# Altium project Isolated_Oscilloscope_Diferential_Probe.PrjPcb (part 1 of 2)
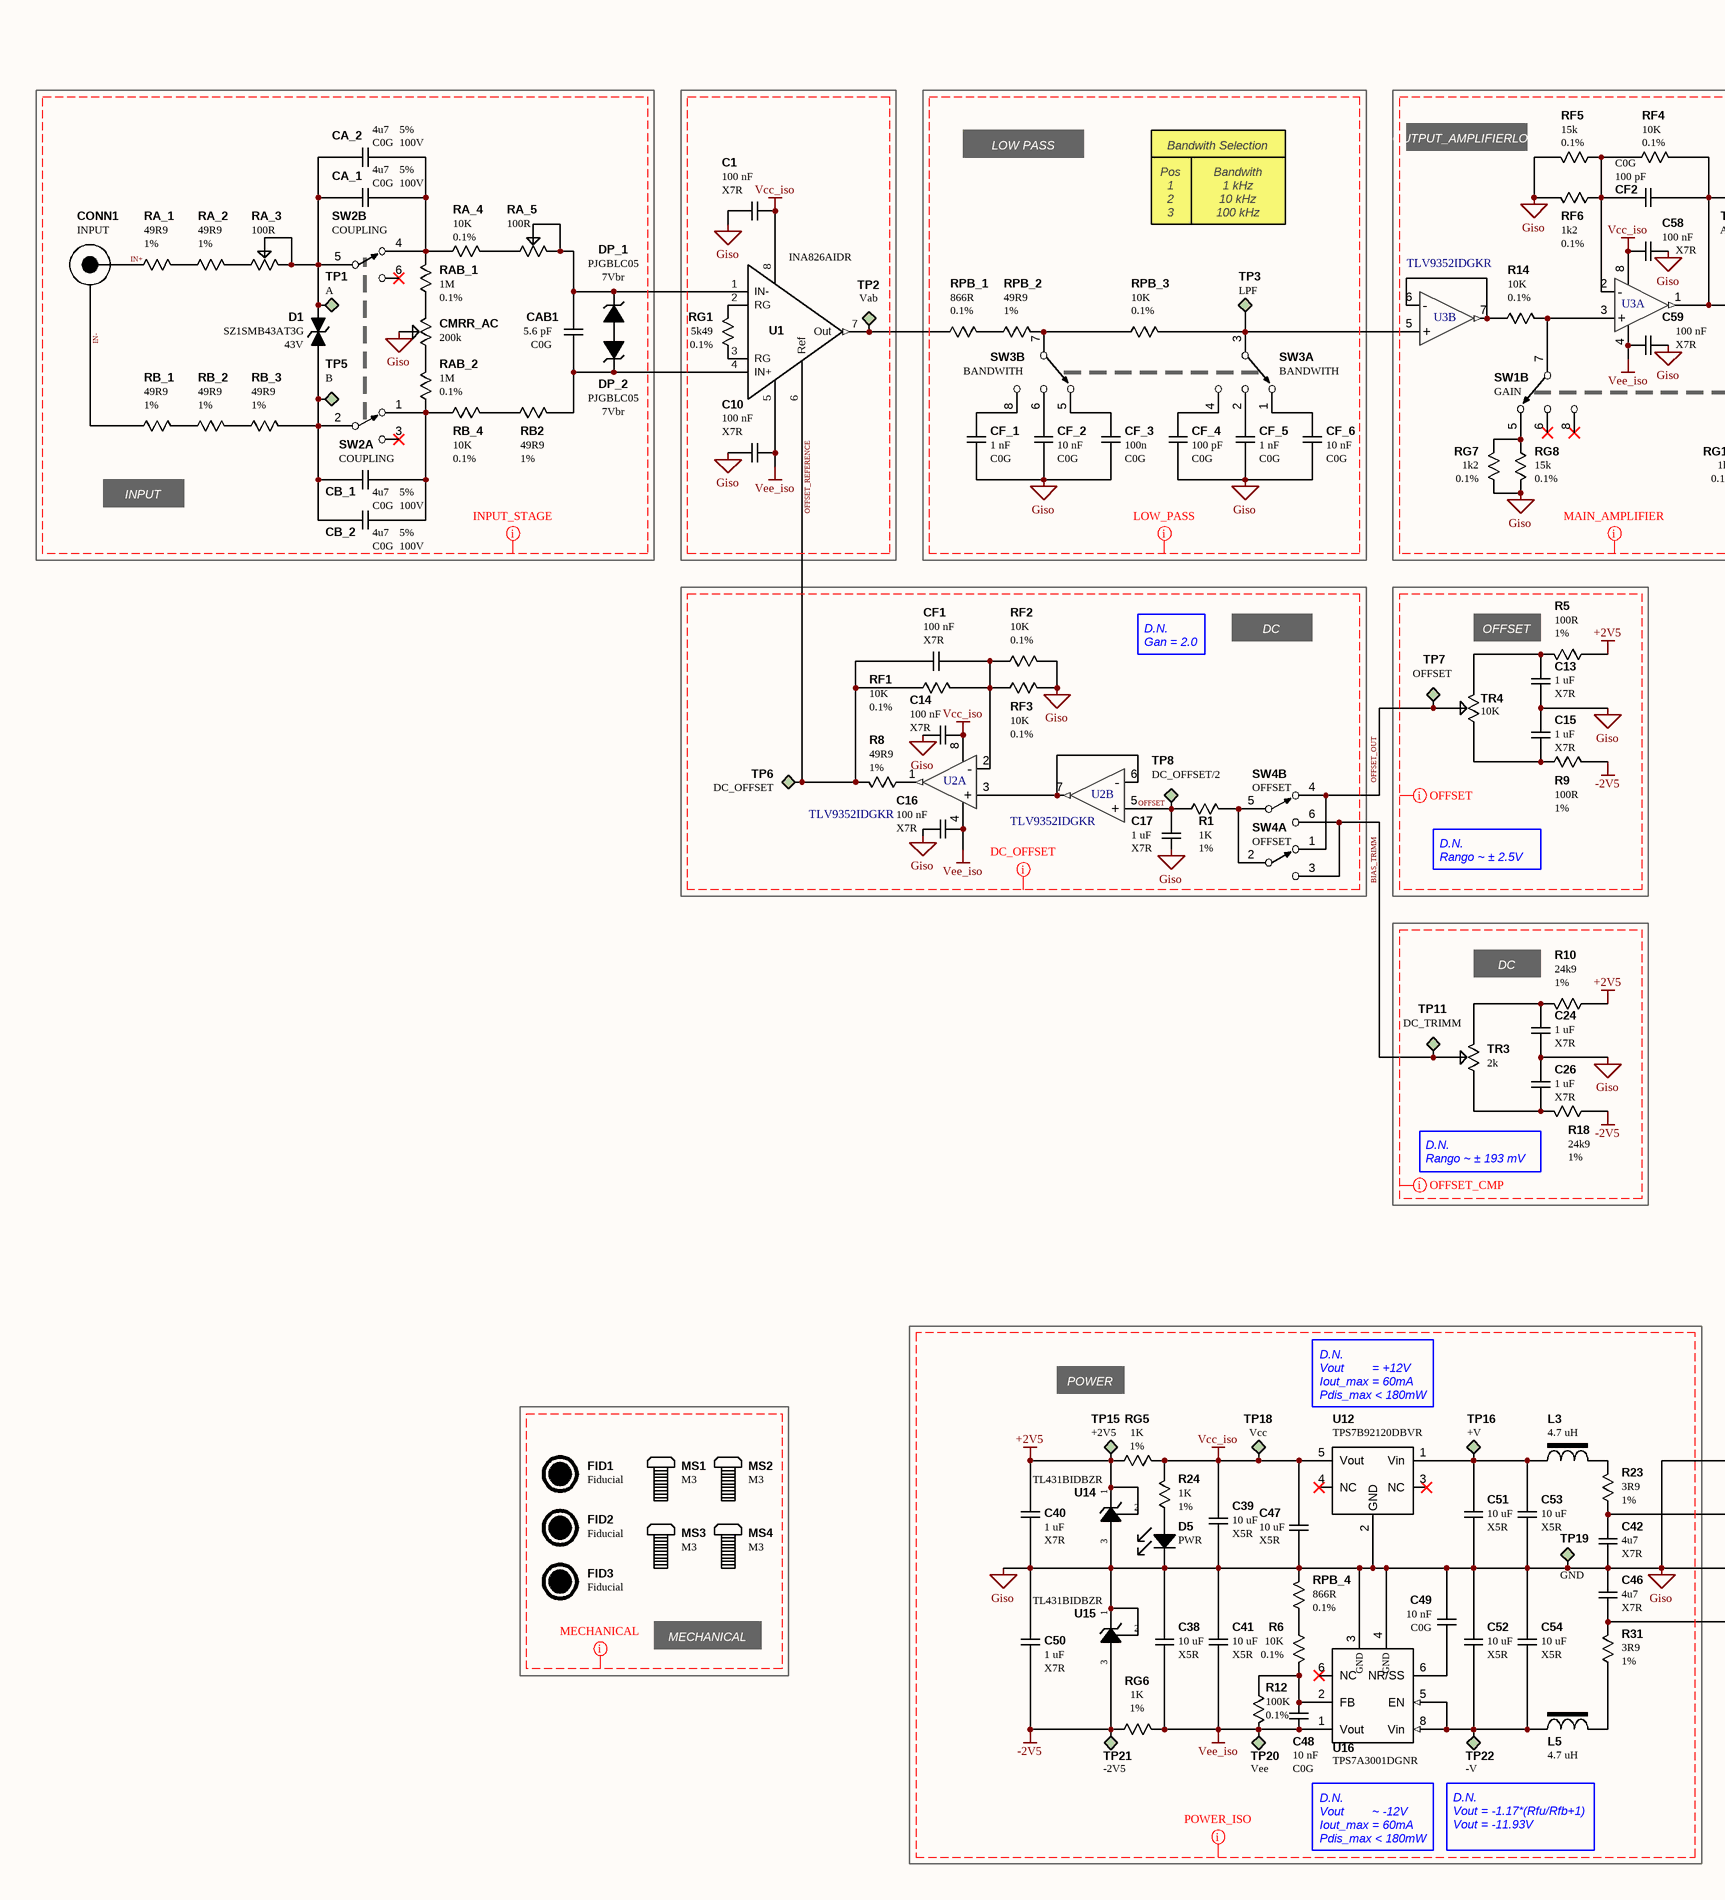
[diagram p0: Isolated_Oscilloscope_Diferential_Probe.SchDoc, left]
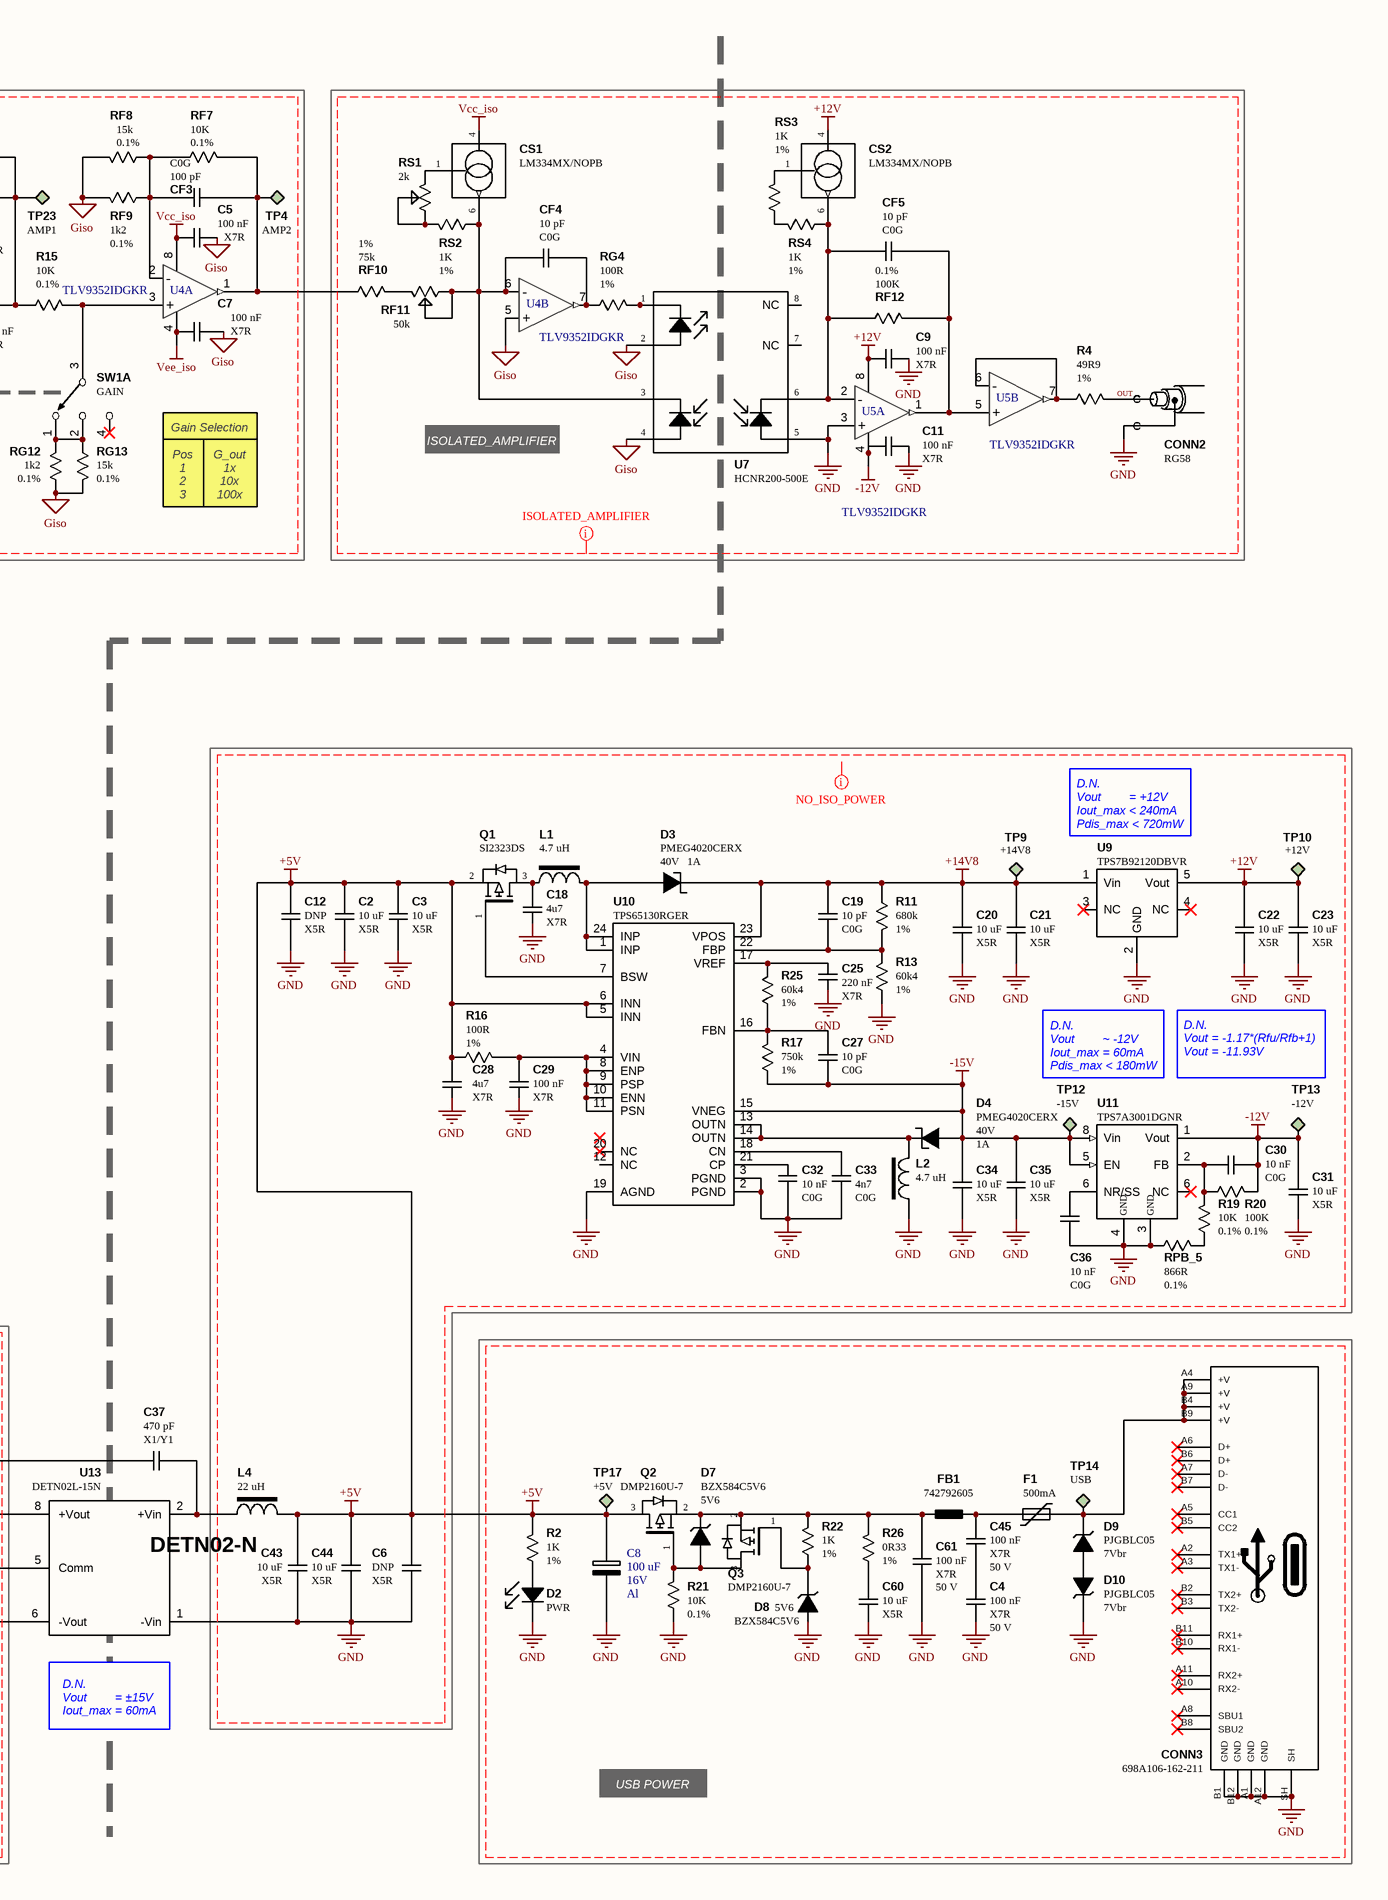
[diagram p1: Isolated_Oscilloscope_Diferential_Probe.SchDoc, right]
1 sheet, 217 parts. Net scope: global (net labels, ports and power ports of the same name join across sheets).
Board file: Isolated_Oscilloscope_Diferential_Probe.PcbDoc

## Sheet Isolated_Oscilloscope_Diferential_Probe.SchDoc: Low Noise Oscilloscope Amplifier
size 594 x 420 mm; Date: 15/04/2026; Revision: A; SheetNumber: 1; SheetTotal: 1

### Parts
C1  100 nF  Dielectrico: X7R  [CAP_SMD_0603]
C2  10 uF  Dielectrico: X5R  [CAP_SMD_0805]
C3  10 uF  Dielectrico: X5R  [CAP_SMD_0805]
C4  100 nF  Tensión: 50 V  Dielectrico: X7R  [CAP_SMD_0603]
C5  100 nF  Dielectrico: X7R  [CAP_SMD_0603]
C6  DNP  Dielectrico: X5R  [CAP_SMD_0805]
C7  100 nF  Dielectrico: X7R  [CAP_SMD_0603]
C8  100 uF  Tensión: 16V  Dielectrico: Al  [CAP_SMD_RADIAL_6.3mm]
C9  100 nF  Dielectrico: X7R  [CAP_SMD_0603]
C10  100 nF  Dielectrico: X7R  [CAP_SMD_0603]
C11  100 nF  Dielectrico: X7R  [CAP_SMD_0603]
C12  DNP  Dielectrico: X5R  [CAP_SMD_0805]
C13  1 uF  Dielectrico: X7R  [CAP_SMD_0805]
C14  100 nF  Dielectrico: X7R  [CAP_SMD_0603]
C15  1 uF  Dielectrico: X7R  [CAP_SMD_0805]
C16  100 nF  Dielectrico: X7R  [CAP_SMD_0603]
C17  1 uF  Dielectrico: X7R  [CAP_SMD_0805]
C18  4u7  Dielectrico: X7R  [CAP_SMD_0805]
C19  10 pF  Dielectrico: C0G  [CAP_SMD_0603]
C20  10 uF  Dielectrico: X5R  [CAP_SMD_0805]
C21  10 uF  Dielectrico: X5R  [CAP_SMD_0805]
C22  10 uF  Dielectrico: X5R  [CAP_SMD_0805]
C23  10 uF  Dielectrico: X5R  [CAP_SMD_0805]
C24  1 uF  Dielectrico: X7R  [CAP_SMD_0805]
C25  220 nF  Dielectrico: X7R  [CAP_SMD_0603]
C26  1 uF  Dielectrico: X7R  [CAP_SMD_0805]
C27  10 pF  Dielectrico: C0G  [CAP_SMD_0603]
C28  4u7  Dielectrico: X7R  [CAP_SMD_0805]
C29  100 nF  Dielectrico: X7R  [CAP_SMD_0603]
C30  10 nF  Dielectrico: C0G  [CAP_SMD_0603]
C31  10 uF  Dielectrico: X5R  [CAP_SMD_0805]
C32  10 nF  Dielectrico: C0G  [CAP_SMD_0603]
C33  4n7  Dielectrico: C0G  [CAP_SMD_0603]
C34  10 uF  Dielectrico: X5R  [CAP_SMD_0805]
C35  10 uF  Dielectrico: X5R  [CAP_SMD_0805]
C36  10 nF  Dielectrico: C0G  [CAP_SMD_0603]
C37  470 pF  Dielectrico: X1/Y1  [Capacitor_Disco_7mm]
C38  10 uF  Dielectrico: X5R  [CAP_SMD_0805]
C39  10 uF  Dielectrico: X5R  [CAP_SMD_0805]
C40  1 uF  Dielectrico: X7R  [CAP_SMD_0805]
C41  10 uF  Dielectrico: X5R  [CAP_SMD_0805]
C42  4u7  Dielectrico: X7R  [CAP_SMD_0805]
C43  10 uF  Dielectrico: X5R  [CAP_SMD_0805]
C44  10 uF  Dielectrico: X5R  [CAP_SMD_0805]
C45  100 nF  Tensión: 50 V  Dielectrico: X7R  [CAP_SMD_0603]
C46  4u7  Dielectrico: X7R  [CAP_SMD_0805]
C47  10 uF  Dielectrico: X5R  [CAP_SMD_0805]
C48  10 nF  Dielectrico: C0G  [CAP_SMD_0603]
C49  10 nF  Dielectrico: C0G  [CAP_SMD_0603]
C50  1 uF  Dielectrico: X7R  [CAP_SMD_0805]
C51  10 uF  Dielectrico: X5R  [CAP_SMD_0805]
C52  10 uF  Dielectrico: X5R  [CAP_SMD_0805]
C53  10 uF  Dielectrico: X5R  [CAP_SMD_0805]
C54  10 uF  Dielectrico: X5R  [CAP_SMD_0805]
C58  100 nF  Dielectrico: X7R  [CAP_SMD_0603]
C59  100 nF  Dielectrico: X7R  [CAP_SMD_0603]
C60  10 uF  Dielectrico: X5R  [CAP_SMD_0805]
C61  100 nF  Tensión: 50 V  Dielectrico: X7R  [CAP_SMD_0603]
CA_1  4u7  Tolerancia: 5%  Tensión: 100V  Dielectrico: C0G  [Capacitor_Poliester_15.0mm]
CA_2  4u7  Tolerancia: 5%  Tensión: 100V  Dielectrico: C0G  [Capacitor_Poliester_15.0mm]
CAB1  5.6 pF  Dielectrico: C0G  [CAP_SMD_0603]
CB_1  4u7  Tolerancia: 5%  Tensión: 100V  Dielectrico: C0G  [Capacitor_Poliester_15.0mm]
CB_2  4u7  Tolerancia: 5%  Tensión: 100V  Dielectrico: C0G  [Capacitor_Poliester_15.0mm]
CF1  100 nF  Dielectrico: X7R  [CAP_SMD_0603]
CF2  100 pF  Dielectrico: C0G  [CAP_SMD_0603]
CF3  100 pF  Dielectrico: C0G  [CAP_SMD_0603]
CF4  10 pF  Dielectrico: C0G  [CAP_SMD_0603]
CF5  10 pF  Dielectrico: C0G  [CAP_SMD_0603]
CF_1  1 nF  Dielectrico: C0G  [CAP_SMD_0603]
CF_2  10 nF  Dielectrico: C0G  [CAP_SMD_0603]
CF_3  100n  Dielectrico: C0G  [CAP_SMD_0603]
CF_4  100 pF  Dielectrico: C0G  [CAP_SMD_0603]
CF_5  1 nF  Dielectrico: C0G  [CAP_SMD_0603]
CF_6  10 nF  Dielectrico: C0G  [CAP_SMD_0603]
CMRR_AC  200k  [Trimpot J-Lead]
CONN1  INPUT  [CONBNC002]
CONN2  RG58  [Coaxial_RG58]  (no BOM)
CONN3  698A106-162-211  [1054500101]
CS1  LM334MX/NOPB  [SOIC_8_IPC]
CS2  LM334MX/NOPB  [SOIC_8_IPC]
D1  SZ1SMB43AT3G  Tensión: 43V  [DO_214AA]
D2  PWR  [LED_0603_1608]
D3  PMEG4020CERX  Tensión: 40V  Corriente: 1A  [SOD_123W]
D4  PMEG4020CERX  Tensión: 40V  Corriente: 1A  [SOD_123W]
D5  PWR  [LED_0603_1608]
D7  BZX584C5V6  Tensión de trabajo: 5V6  [SOD_523]
D8  BZX584C5V6  Tensión de trabajo: 5V6  [SOD_523]
D9  PJGBLC05  Tensión de trabajo: 7Vbr  [SOD_323]
D10  PJGBLC05  Tensión de trabajo: 7Vbr  [SOD_323]
DP_1  PJGBLC05  Tensión de trabajo: 7Vbr  [SOD_323]
DP_2  PJGBLC05  Tensión de trabajo: 7Vbr  [SOD_323]
F1  Corriente: 500mA  [RES_SMD_1210]  (hidden comment: SMD1206B050TF/15)
FB1  742792605  [FERRITE_SMD_0603]
FID1  Fiducial  [Fiducial]  (no BOM)
FID2  Fiducial  [Fiducial]  (no BOM)
FID3  Fiducial  [Fiducial]  (no BOM)
L1  4.7 uH  [IND_DRUM_4.80x4.80mm]
L2  4.7 uH  [IND_DRUM_4.80x4.80mm]
L3  4.7 uH  [IND_DRUM_4.80x4.80mm]
L4  22 uH  [IND_DRUM_5.00x5.00mm]
L5  4.7 uH  [IND_DRUM_4.80x4.80mm]
MS1  M3  [Orificio_M3]  (no BOM)
MS2  M3  [Orificio_M3]  (no BOM)
MS3  M3  [Orificio_M3]  (no BOM)
MS4  M3  [Orificio_M3]  (no BOM)
Q1  SI2323DS  [SOT_23-3]
Q2  DMP2160U-7  [SOT_23-3]
Q3  DMP2160U-7  [SOT_23-3]
R1  1K  Tolerancia: 1%  [RES_SMD_0603]
R2  1K  Tolerancia: 1%  [RES_SMD_0603]
R4  49R9  Tolerancia: 1%  [RES_SMD_0603]
R5  100R  Tolerancia: 1%  [RES_SMD_0603]
R6  10K  Tolerancia: 0.1%  [RES_SMD_0603]
R8  49R9  Tolerancia: 1%  [RES_SMD_0603]
R9  100R  Tolerancia: 1%  [RES_SMD_0603]
R10  24k9  Tolerancia: 1%  [RES_SMD_0603]
R11  680k  Tolerancia: 1%  [RES_SMD_0603]
R12  100K  Tolerancia: 0.1%  [RES_SMD_0603]
R13  60k4  Tolerancia: 1%  [RES_SMD_0603]
R14  10K  Tolerancia: 0.1%  [RES_SMD_0603]
R15  10K  Tolerancia: 0.1%  [RES_SMD_0603]
R16  100R  Tolerancia: 1%  [RES_SMD_0603]
R17  750k  Tolerancia: 1%  [RES_SMD_0603]
R18  24k9  Tolerancia: 1%  [RES_SMD_0603]
R19  10K  Tolerancia: 0.1%  [RES_SMD_0603]
R20  100K  Tolerancia: 0.1%  [RES_SMD_0603]
R21  10K  Tolerancia: 0.1%  [RES_SMD_0603]
R22  1K  Tolerancia: 1%  [RES_SMD_0603]
R23  3R9  Tolerancia: 1%  [RES_SMD_0603]
R24  1K  Tolerancia: 1%  [RES_SMD_0603]
R25  60k4  Tolerancia: 1%  [RES_SMD_0603]
R26  0R33  Tolerancia: 1%  [RES_SMD_0603]
R31  3R9  Tolerancia: 1%  [RES_SMD_0603]
RA_1  49R9  Tolerancia: 1%  [RES_SMD_0603]
RA_2  49R9  Tolerancia: 1%  [RES_SMD_0603]
RA_3  100R  [Trimpot J-Lead]
RA_4  10K  Tolerancia: 0.1%  [RES_SMD_0603]
RA_5  100R  [Trimpot J-Lead]
RAB_1  1M  Tolerancia: 0.1%  [RES_SMD_0603]
RAB_2  1M  Tolerancia: 0.1%  [RES_SMD_0603]
RB2  49R9  Tolerancia: 1%  [RES_SMD_0603]
RB_1  49R9  Tolerancia: 1%  [RES_SMD_0603]
RB_2  49R9  Tolerancia: 1%  [RES_SMD_0603]
RB_3  49R9  Tolerancia: 1%  [RES_SMD_0603]
RB_4  10K  Tolerancia: 0.1%  [RES_SMD_0603]
RF1  10K  Tolerancia: 0.1%  [RES_SMD_0603]
RF2  10K  Tolerancia: 0.1%  [RES_SMD_0603]
RF3  10K  Tolerancia: 0.1%  [RES_SMD_0603]
RF4  10K  Tolerancia: 0.1%  [RES_SMD_0603]
RF5  15k  Tolerancia: 0.1%  [RES_SMD_0603]
RF6  1k2  Tolerancia: 0.1%  [RES_SMD_0603]
RF7  10K  Tolerancia: 0.1%  [RES_SMD_0603]
RF8  15k  Tolerancia: 0.1%  [RES_SMD_0603]
RF9  1k2  Tolerancia: 0.1%  [RES_SMD_0603]
RF10  75k  Tolerancia: 1%  [RES_SMD_0603]
RF11  50k  [Trimpot J-Lead]
RF12  100K  Tolerancia: 0.1%  [RES_SMD_0603]
RG1  5k49  Tolerancia: 0.1%  [RES_SMD_0603]
RG4  100R  Tolerancia: 1%  [RES_SMD_0603]
RG5  1K  Tolerancia: 1%  [RES_SMD_0603]
RG6  1K  Tolerancia: 1%  [RES_SMD_0603]
RG7  1k2  Tolerancia: 0.1%  [RES_SMD_0603]
RG8  15k  Tolerancia: 0.1%  [RES_SMD_0603]
RG12  1k2  Tolerancia: 0.1%  [RES_SMD_0603]
RG13  15k  Tolerancia: 0.1%  [RES_SMD_0603]
RPB_1  866R  Tolerancia: 0.1%  [RES_SMD_0603]
RPB_2  49R9  Tolerancia: 1%  [RES_SMD_0603]
RPB_3  10K  Tolerancia: 0.1%  [RES_SMD_0603]
RPB_4  866R  Tolerancia: 0.1%  [RES_SMD_0603]
RPB_5  866R  Tolerancia: 0.1%  [RES_SMD_0603]
RS1  2k  [Trimpot J-Lead]
RS2  1K  Tolerancia: 1%  [RES_SMD_0603]
RS3  1K  Tolerancia: 1%  [RES_SMD_0603]
RS4  1K  Tolerancia: 1%  [RES_SMD_0603]
SW1  GAIN  [EG2301B]  (parts A,B of 2)
SW2  COUPLING  [EG2201B]  (parts A,B of 2)
SW3  BANDWITH  [EG2301B]  (parts A,B of 2)
SW4  OFFSET  [EG2201B]  (parts A,B of 2)
TP1  A  [Test_Point_THT]  (no BOM)
TP2  Vab  [Test_Point_THT]  (no BOM)
TP3  LPF  [Test_Point_THT]  (no BOM)
TP4  AMP2  [Test_Point_THT]  (no BOM)
TP5  B  [Test_Point_THT]  (no BOM)
TP6  DC_OFFSET  [Test_Point_THT]  (no BOM)
TP7  OFFSET  [Test_Point_THT]  (no BOM)
TP8  DC_OFFSET/2  [Test_Point_THT]  (no BOM)
TP9  +14V8  [Test_Point_SMD]  (no BOM)
TP10  +12V  [Test_Point_SMD]  (no BOM)
TP11  DC_TRIMM  [Test_Point_THT]  (no BOM)
TP12  -15V  [Test_Point_SMD]  (no BOM)
TP13  -12V  [Test_Point_SMD]  (no BOM)
TP14  USB  [Test_Point_THT]  (no BOM)
TP15  +2V5  [Test_Point_THT]  (no BOM)
TP16  +V  [Test_Point_SMD]  (no BOM)
TP17  +5V  [Test_Point_THT]  (no BOM)
TP18  Vcc  [Test_Point_THT]  (no BOM)
TP19  GND  [Test_Point_SMD]  (no BOM)
TP20  Vee  [Test_Point_SMD]  (no BOM)
TP21  -2V5  [Test_Point_THT]  (no BOM)
TP22  -V  [Test_Point_SMD]  (no BOM)
TP23  AMP1  [Test_Point_THT]  (no BOM)
TR3  2k  [Trimpot J-Lead]
TR4  10K  [POTENCIOMETRO_RK09K1130081]
U1  INA826AIDR  [SOIC_8_IPC]
U2  TLV9352IDGKR  [VSSOP_8_Standard]  (parts A,B of 2)
U3  TLV9352IDGKR  [VSSOP_8_Standard]  (value not drawn)  (parts A,B of 2)
U4  TLV9352IDGKR  [VSSOP_8_Standard]  (parts A,B of 2)
U5  TLV9352IDGKR  [VSSOP_8_Standard]  (parts A,B of 2)
U7  HCNR200-500E  [DIP_8]
U9  TPS7B92120DBVR  [SOT_23-5]
U10  TPS65130RGER  [VFQN_24]
U11  TPS7A3001DGNR  [VSSOP_8]
U12  TPS7B92120DBVR  [SOT_23-5]
U13  DETN02L-15N  [DETN02-N]
U14  TL431BIDBZR  [SOT_23-3]
U15  TL431BIDBZR  [SOT_23-3]
U16  TPS7A3001DGNR  [VSSOP_8]

### Nets
+2V5: C40.2 R5.1 R10.1 RG5.1 TP15.1 U14.1 U14.2
+5V: C2.1 C3.1 C6.1 C8.1 C12.1 C28.2 C43.1 C44.1 L4.1 Q1.2(S) Q2.3(D) R2.2 R16.1 TP17.1 U10.5(INN) U10.6(INN)
+12V: C9.2 C22.1 C23.1 CS2.4(Vi+) TP10.1 U5.8(VCC) U9.5(Vout)
+14V8: C19.1 C20.1 C21.1 D3.K R11.1 TP9.1 U9.1(Vin) U10.23(VPOS)
-2V5: C50.1 R9.2 R18.1 RG6.1 TP21.1 U15.3
-12V: C11.2 C30.2 C31.1 R20.2 TP13.1 U5.4(GND) U11.1(Vout)
-15V: C27.2 C34.1 C35.1 D4.A R17.1 TP12.1 U10.15(VNEG) U11.5(EN) U11.8(Vin)
Giso: C1.1 C5.1 C7.1 C10.1 C13.1 C14.1 C15.2 C16.1 C17.1 C24.1 C26.2 C37.1 C38.1 C39.2 C40.1 C41.1 C42.1 C46.2 C47.2 C49.1 C50.2 C51.2 C52.1 C53.2 C54.1 C58.1 C59.1 CF_1.1 CF_2.1 CF_3.1 CF_4.1 CF_5.1 CF_6.1 CMRR_AC.3 D5.K RF2.2 RF3.2 RF5.2 RF6.2 RF8.2 RF9.2 RG7.1 RG8.2 RG12.1 RG13.2 RPB_4.2 TP19.1 U4.5(+) U7.2(LED+) U7.4(PD1+) U12.2(GND) U13.5(Comm) U14.3 U15.1 U15.2 U16.3(GND) U16.4(GND)
GND: C2.2 C3.2 C4.1 C6.2 C8.2 C9.1 C11.1 C12.2 C18.1 C20.2 C21.2 C22.2 C23.2 C25.1 C28.1 C29.1 C31.2 C32.1 C33.1 C34.2 C35.2 C36.2 C43.2 C44.2 C60.2 C61.1 CONN2.2 CONN3.A1(GND) CONN3.A12(GND) CONN3.B1(GND) CONN3.B12(GND) CONN3.SH D2.K D8.A D10.K L2.2 R13.1 R21.1 RPB_5.1 U5.3(+) U7.5(PD2+) U9.2(GND) U10.2(PGND) U10.3(PGND) U10.19(AGND) U11.3(GND) U11.4(GND) U13.1(-Vin)
Vcc_iso: C1.2 C5.2 C14.2 C39.1 C47.1 C58.2 CS1.4(Vi+) R24.2 RG5.2 TP18.1 U1.8(Vcc) U2.8(VCC) U3.8(VCC) U4.8(VCC) U12.5(Vout)
Vee_iso: C7.2 C10.2 C16.2 C38.2 C41.2 C48.2 C59.2 R12.2 RG6.2 TP20.1 U1.5(Vee) U2.4(GND) U3.4(GND) U4.4(GND) U16.1(Vout)
BIAS_TRIMM: SW4.3(NO1) SW4.6(NO2) TP11.1 TR3.3
IN+: CONN1.1(SIGNAL) RA_1.1
IN-: CONN1.2 RB_1.1
OFFSET: C17.2 R1.1 TP8.1 U2.5(+)
OFFSET_OUT: SW4.1(NC1) SW4.4(NC2) TP7.1 TR4.3
OFFSET_REFERENCE: CF1.1 R8.2 RF1.1 TP6.1 U1.6(Ref)
OUT: CONN2.1 R4.2
NetC4_2: C4.2 C45.1
NetC13_2: C13.2 R5.2 TR4.1
NetC15_1: C15.1 R9.1 TR4.2
NetC18_2: C18.2 L1.2 Q1.3(D)
NetC19_2: C19.2 R11.2 R13.2 U10.22(FBP)
NetC24_2: C24.2 R10.2 TR3.2
NetC25_2: C25.2 R25.2 U10.17(VREF)
NetC26_1: C26.1 R18.2 TR3.1
NetC27_1: C27.1 R17.2 R25.1 U10.16(FBN)
NetC29_2: C29.2 R16.2 U10.4(VIN) U10.8(ENP) U10.9(PSP) U10.10(ENN) U10.11(PSN)
NetC30_1: C30.1 R19.2 R20.1 U11.2(FB)
NetC32_2: C32.2 U10.21(CP)
NetC33_2: C33.2 U10.18(CN)
NetC36_1: C36.1 U11.6(NR/SS)
NetC37_2: C37.2 L4.2 U13.2(+Vin)
NetC42_2: C42.2 R23.2 U13.8(+Vout)
NetC45_2: C45.2 F1.2 FB1.2
NetC46_1: C46.1 R31.1 U13.6(-Vout)
NetC48_1: C48.1 R6.2 R12.1 U16.2(FB)
NetC49_2: C49.2 U16.6(NR/SS)
NetC51_1: C51.1 C53.1 L3.2 TP16.1 U12.1(Vin)
NetC52_2: C52.2 C54.2 L5.2 TP22.1 U16.5(EN) U16.8(Vin)
NetC60_1: C60.1 R26.2
NetC61_2: C61.2 D7.K FB1.1 Q2.2(S) Q3.2(S) R22.2 R26.1
NetCA_1_1: CA_1.1 CA_2.1 RA_4.1 RAB_1.2 SW2.4(NC2)
NetCA_1_2: CA_1.2 CA_2.2 D1.K RA_3.2 RA_3.3 SW2.5(COM2) TP1.1
NetCAB1_1: CAB1.1 DP_2.K RB2.2 U1.4(IN+)
NetCAB1_2: CAB1.2 DP_1.K RA_5.2 RA_5.3 U1.1(IN-)
NetCB_1_1: CB_1.1 CB_2.1 RAB_2.1 RB_4.1 SW2.1(NC1)
NetCB_1_2: CB_1.2 CB_2.2 D1.A RB_3.2 SW2.2(COM1) TP5.1
NetCF1_2: CF1.2 RF1.2 RF2.1 RF3.1 U2.2(-)
NetCF2_1: CF2.1 RF4.1 RF5.1 RF6.1 U3.2(-)
NetCF2_2: CF2.2 R15.1 RF4.2 TP23.1 U3.1(OUT)
NetCF3_1: CF3.1 RF7.1 RF8.1 RF9.1 U4.2(-)
NetCF3_2: CF3.2 RF7.2 RF10.1 TP4.1 U4.1(OUT)
NetCF4_1: CF4.1 RG4.1 U4.7(OUT)
NetCF4_2: CF4.2 CS1.6(v-) RF11.1 RF11.3 RS2.1 U4.6(-) U7.3(PD1-)
NetCF5_1: CF5.1 RF12.2 U5.1(OUT) U5.5(+)
NetCF5_2: CF5.2 CS2.6(v-) RF12.1 RS4.1 U5.2(-) U7.6(PD2-)
NetCF_1_2: CF_1.2 SW3.8(POS3_2)
NetCF_2_2: CF_2.2 SW3.6(POS2_2)
NetCF_3_2: CF_3.2 SW3.5(POS1_2)
NetCF_4_2: CF_4.2 SW3.4(POS3)
NetCF_5_2: CF_5.2 SW3.2(POS2)
NetCF_6_2: CF_6.2 SW3.1(POS1)
NetCMRR_AC_1: CMRR_AC.1 RAB_1.1
NetCMRR_AC_2: CMRR_AC.2 RAB_2.2
NetCONN3_A4: CONN3.A4(+V) CONN3.A9(+V) CONN3.B4(+V) CONN3.B9(+V) D9.K F1.1 TP14.1
NetCS1_1: CS1.1(ADJ) RS1.1
NetCS2_1: CS2.1(ADJ) RS3.2
NetD2_A: D2.A R2.1
NetD3_A: D3.A L1.1 U10.1(INP) U10.24(INP)
NetD4_K: D4.K L2.1 U10.13(OUTN) U10.14(OUTN)
NetD5_A: D5.A R24.1
NetD7_A: D7.A Q2.1(G) Q3.3(D) R21.2
NetD8_K: D8.K Q3.1(G) R22.1
NetD9_A: D9.A D10.A
NetDP_1_A: DP_1.A DP_2.A
NetL3_1: L3.1 R23.1
NetL5_1: L5.1 R31.2
NetQ1_1: Q1.1(G) U10.7(BSW)
NetR1_2: R1.2 SW4.2(COM1) SW4.5(COM2)
NetR4_1: R4.1 U5.6(-) U5.7(OUT)
NetR6_1: R6.1 RPB_4.1
NetR8_1: R8.1 U2.1(OUT)
NetR14_1: R14.1 U3.6(-) U3.7(OUT)
NetR14_2: R14.2 SW1.7(COMM2) U3.3(+)
NetR15_2: R15.2 SW1.3(COMM1) U4.3(+)
NetR19_1: R19.1 RPB_5.2
NetRA_1_2: RA_1.2 RA_2.1
NetRA_2_2: RA_2.2 RA_3.1
NetRA_4_2: RA_4.2 RA_5.1
NetRB2_1: RB2.1 RB_4.2
NetRB_1_2: RB_1.2 RB_2.1
NetRB_2_2: RB_2.2 RB_3.1
NetRF10_2: RF10.2 RF11.2
NetRG1_1: RG1.1 U1.2(RG)
NetRG1_2: RG1.2 U1.3(RG)
NetRG4_2: RG4.2 U7.1(LED-)
NetRG7_2: RG7.2 RG8.1 SW1.5(POS1_2)
NetRG12_2: RG12.2 RG13.1 SW1.1(POS1) SW1.2(POS2)
NetRPB_1_1: RPB_1.1 TP2.1 U1.7(Out)
NetRPB_1_2: RPB_1.2 RPB_2.1
NetRPB_2_2: RPB_2.2 RPB_3.1 SW3.7(COMM2)
NetRPB_3_2: RPB_3.2 SW3.3(COMM1) TP3.1 U3.5(+)
NetRS1_2: RS1.2 RS1.3 RS2.2
NetRS3_1: RS3.1 RS4.2
NetU2_3: U2.3(+) U2.6(-) U2.7(OUT)

Not connected (* = marked no-connect by the designer): CONN3 A2(TX1+)* A3(TX1-)* A5(CC1)* A6(D+)* A7(D-)* A8(SBU1)* A10(RX2-)* A11(RX2+)* B2(TX2+)* B3(TX2-)* B5(CC2)* B6(D+)* B7(D-)* B8(SBU2)* B10(RX1-)* B11(RX1+)*; FID1 5; FID2 5; FID3 5; MS1 5; MS2 5; MS3 5; MS4 5; SW1 4(POS3)* 6(POS2_2)* 8(POS3_2)*; SW2 3(NO1)* 6(NO2)*; U7 7(NC) 8(NC); U9 3(NC)* 4(NC)*; U10 12(NC) 20(NC)*; U12 3(NC)* 4(NC)*

### Layout directives
CompClassName: POWER_ISO; net class POWER_ISO: +2V5, -2V5, Giso, Vcc_iso, Vee_iso
CompClassName: OFFSET_COMP; net class OFFSET_COMP: +2V5, -2V5, Giso
CompClassName: OFFSET; net class OFFSET: +2V5, -2V5, Giso
CompClassName: DC_OFFSET; net class DC_OFFSET: Giso, OFFSET, Vcc_iso, Vee_iso
CompClassName: INPUT_STAGE; net class INPUT_STAGE: Giso, IN+, IN-
CompClassName: LOW_PASS; net class LOW_PASS: Giso
CompClassName: MAIN_AMPLIFIER; net class MAIN_AMPLIFIER: Giso, Vcc_iso, Vee_iso
CompClassName: MECHANICAL; net class MECHANICAL: (no net found under the mark)
CompClassName: ISOLATED_AMPLIFIER; net class ISOLATED_AMPLIFIER: +12V, -12V, Giso, GND, OUT, Vcc_iso
CompClassName: NO_ISO_POWER; net class NO_ISO_POWER: +5V, +12V, +14V8, -12V, -15V, GND

### Notes on the sheet
- LOW PASS FILTER
- Bandwith Selection
- (near RF5) OUTPUT_AMPLIFIERLOW PASS FILTER
- Pos
  1
  2
  3
- Bandwith
  1 kHz
  10 kHz
  100 kHz
- Gain Selection
- ISOLATED_AMPLIFIER
- INPUT STAGE
- G_out
  1x
  10x
  100x
- D.N.
  Gan = 2.0
- DC OFFSET
- (near R5) OFFSET
- D.N.
  Rango ~ ± 2.5V
- D.N.
  Vout        = +12V
  Iout_max < 240mA
  Pdis_max < 720mW
- DC ZERO
- D.N.
  Vout        ~ -12V
  Iout_max = 60mA
  Pdis_max < 180mW
- D.N.
  Vout = -1.17*(Rfu/Rfb+1)
  Vout = -11.93V
- D.N.
  Rango ~ ± 193 mV
- POWER
- D.N.
  Vout        = +12V
  Iout_max = 60mA
  Pdis_max < 180mW
- MECHANICAL
- (near U13) D.N.
  Vout        = ±15V
  Iout_max = 60mA
- USB POWER
- TITLE
- A2
- SIZE
- DATE :
- REV :
- FILE :
- SHEET
- OF